# EAGLE design SINGLE KEY MACROcorrectfootprint (EAGLE 9.6.2)
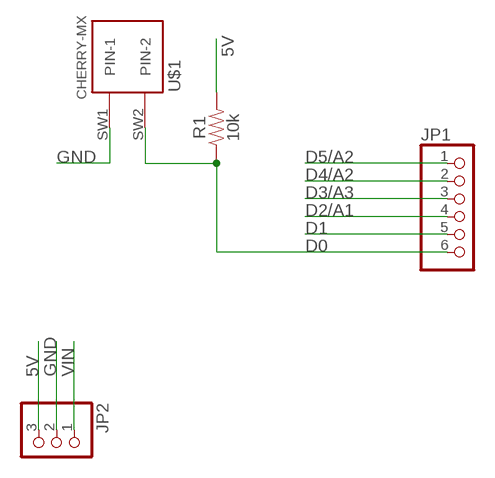
[diagram p0: schematic, sheet 1]

## Parts
JP1  PINHD-1X6  [1X06]
JP2  PINHD-1X3  [1X03]
R1  10k  10KOHM-HORIZ-1/4W-1%  [AXIAL-0.3]
U$1  CHERRY-MX  [CHERRY-MX]

## Nets
5V: JP2.3 R1.P$2
D0: JP1.6 R1.P$1 U$1.SW2(PIN-2)
D1: JP1.5
D2/A1: JP1.4
D3/A3: JP1.3
D4/A2: JP1.2
D5/A2: JP1.1
GND: JP2.2 U$1.SW1(PIN-1)
VIN: JP2.1

## Library data of the parts
JP1 = pinhead:PINHD-1X6: PIN HEADER
JP2 = pinhead:PINHD-1X3: PIN HEADER
R1 = SparkFun-Resistors:10KOHM: 10kΩ resistor A resistor is a passive two-terminal electrical component that implements electrical resistance as a circuit element. Resistors act to reduce current flow, and, at the same time, act to lower voltage levels within circuits. - Wikipedia; PROD_ID: RES-12183
U$1 = cherrymx:CHERRY-MX: Cherry MX series keyswitch

## Net classes
0 default: width 0.406 mm

## Board
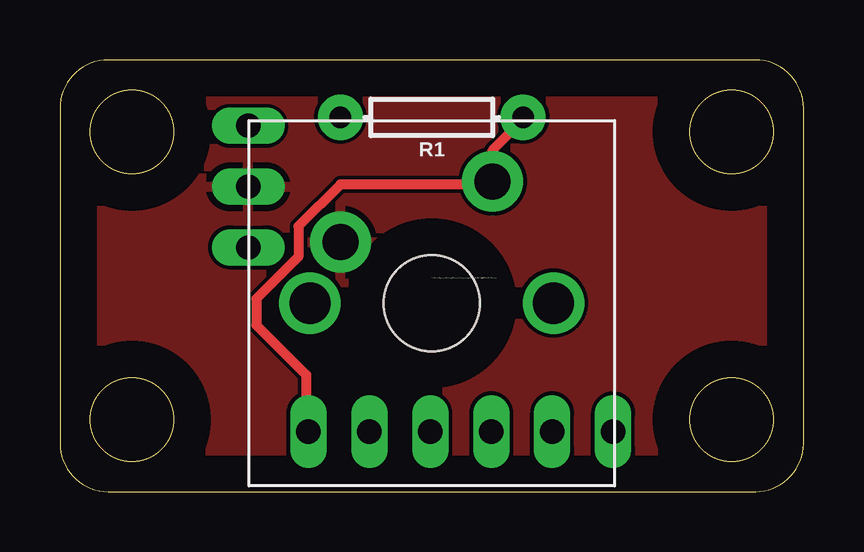
[diagram p1: board, top side]
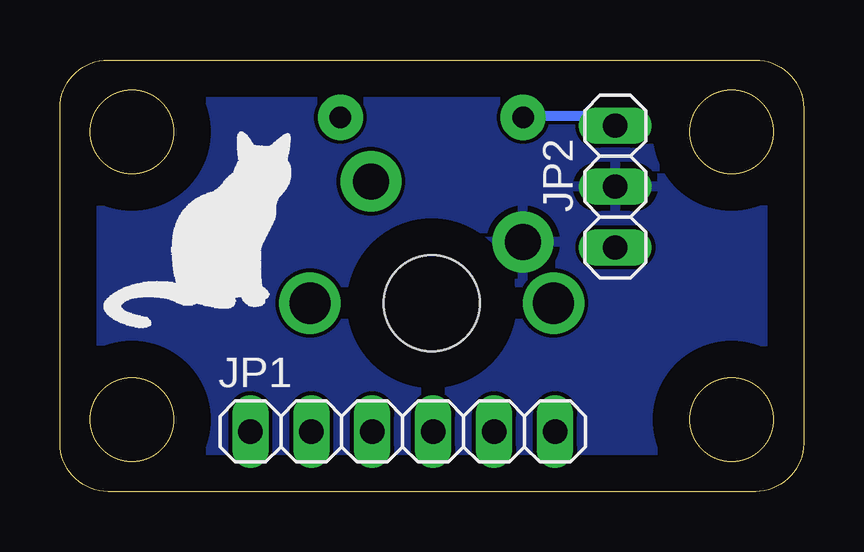
[diagram p2: board, bottom side, seen from below]

Size 31 x 18 mm. Coordinates in mm from the lower left corner, seen from the top.
Outline: 2,0 29,0 arc90 31,2 31,16 arc90 29,18 2,18 arc90 0,16 0,2 arc90 2,0
Outline: circle at 3,15 radius 1.75
Outline: circle at 3,3 radius 1.75
Outline: circle at 28,3 radius 1.75
Outline: circle at 28,15 radius 1.75
Outline: circle at 3,15 radius 1.75
Outline: circle at 3,3 radius 1.75
Outline: circle at 28,3 radius 1.75
Outline: circle at 28,15 radius 1.75
Copper layers (1*16): Top 0.035mm / dielectric 1.5mm / Bottom 0.035mm
Design rules "default *": minimum track width 6mil, minimum drill 0.35mm, track to track 6mil, track to pad 6mil, pad to pad 6mil, via to via 6mil, smd to smd 6mil, copper to edge 60mil, drill to drill 16mil, minimum pad ring 10mil, minimum via ring 8mil, stop-mask expansion 4mil, vias tented up to drill 0mil, thermal gap 10mil
tKeepout: area 0.2,12.1 to 5.9,17.8; area 0.2,0.2 to 5.9,5.9; area 25.1,12.1 to 30.8,17.8; area 25.1,0.2 to 30.8,5.9
bKeepout: area 25.1,12.1 to 30.8,17.8; area 0.2,12.1 to 5.9,17.8; area 0.2,0.2 to 5.9,5.9; area 25.1,0.2 to 30.8,5.9

### Footprints (pad centres in the part's own frame; a part is rotated, then mirrored left to right if it is on the bottom)
1X06 = drill 1.016 long: 1 -6.35,0; 2 -3.81,0; 3 -1.27,0; 4 1.27,0; 5 3.81,0; 6 6.35,0
1X03 = drill 1.016 long: 1 -2.54,0; 2 0,0; 3 2.54,0
AXIAL-0.3 = drill 0.9 pad 1.88: P$1 -3.81,0; P$2 3.81,0
CHERRY-MX = drill 1.714 pad 1.93: P$3 -5.08,0; P$4 5.08,0 | drill 1.5 pad 2.54: SW1 -3.81,2.54; SW2 2.54,5.08 | hole 4: 0,0

### Placement (x,y rotation side)
JP1  16.71,2.51 0 bottom
JP2  7.85,12.72 90 bottom
R1  15.5,15.6 180 top
U$1  15.5,7.86 0 top

### Tracks (layer width: path | path; a pad name or v marks a point on that pad's centre or on a via)
5V
  Bottom 0.406: JP2.3 7.88,15.35 8.2,15.67 11.69,15.67 R1.P$2
D0
  Top 0.406: JP1.6 10.26,2.65 10.26,4.87 8.2,6.94 8.2,8.05 9.94,9.79 9.94,11.06 11.69,12.81 18.04,12.81 U$1.SW2 18.04,14.24 19.31,15.51 R1.P$1
GND
  pour Top: -1.64,20.43 33.28,20.43 33.28,-1.79 -2.28,-1.79
  pour Bottom: -1.64,20.43 33.28,20.43 33.28,-6.11 -2.4,-6.11

### Text on the board
tPlace: C:/Users/Spencer/Desktop/Personal Projects/wip/SINGLE KEY MACRO/241491.bmp